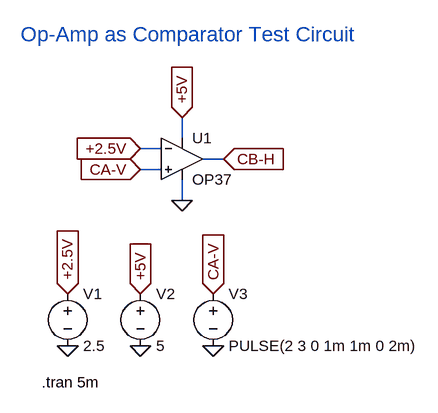
[diagram p0: schematic opamp_comparator_ltspice.asc]
opamp_comparator_ltspice.asc, the LTspice schematic file:
Version 4
SHEET 1 880 680
WIRE 192 144 192 112
WIRE 160 160 128 160
WIRE 256 176 224 176
WIRE 160 192 128 192
WIRE 192 240 192 208
FLAG 192 240 0
FLAG 128 192 CA-V
IOPIN 128 192 In
FLAG 128 160 +2.5V
IOPIN 128 160 In
FLAG 192 112 +5V
IOPIN 192 112 In
FLAG 256 176 CB-H
IOPIN 256 176 In
FLAG 240 384 CA-V
IOPIN 240 384 In
FLAG 16 384 +2.5V
IOPIN 16 384 In
FLAG 128 384 +5V
IOPIN 128 384 In
FLAG 16 464 0
FLAG 128 464 0
FLAG 240 464 0
SYMBOL Opamps\\OP37 192 112 R0
SYMATTR InstName U1
SYMBOL voltage 16 368 R0
SYMATTR InstName V1
SYMATTR Value 2.5
SYMBOL voltage 128 368 R0
WINDOW 123 0 0 Left 0
WINDOW 39 0 0 Left 0
SYMATTR InstName V2
SYMATTR Value 5
SYMBOL voltage 240 368 R0
WINDOW 123 0 0 Left 0
WINDOW 39 0 0 Left 0
SYMATTR InstName V3
SYMATTR Value PULSE(2 3 0 1m 1m 0 2m)
TEXT -56 -16 Left 3 ;Op-Amp as Comparator Test Circuit
TEXT -24 520 Left 2 !.tran 5m

The netlist it stands for:
* opamp_comparator_ltspice.asc
XU1 CA-V +2.5V +5V 0 CB-H LT1037  ; OP37, pins In+ In- V+ V- OUT
V1 +2.5V 0 2.5
V2 +5V 0 5
V3 CA-V 0 PULSE(2 3 0 1m 1m 0 2m)
* Op-Amp as Comparator Test Circuit
.tran 5m
.lib LTC.lib
.backanno
.end